# Altium schematic sheet BOC_ADC_DAC.SchDoc: Board-On-Chip Analog Interface
size A; Organization: Altium Limited; Address1: L3, 12a Rodborough Rd; Address2: Frenchs Forest; Address3: NSW; Address4: Australia 2086; Revision: 1.06; SheetNumber: 14; SheetTotal: 16
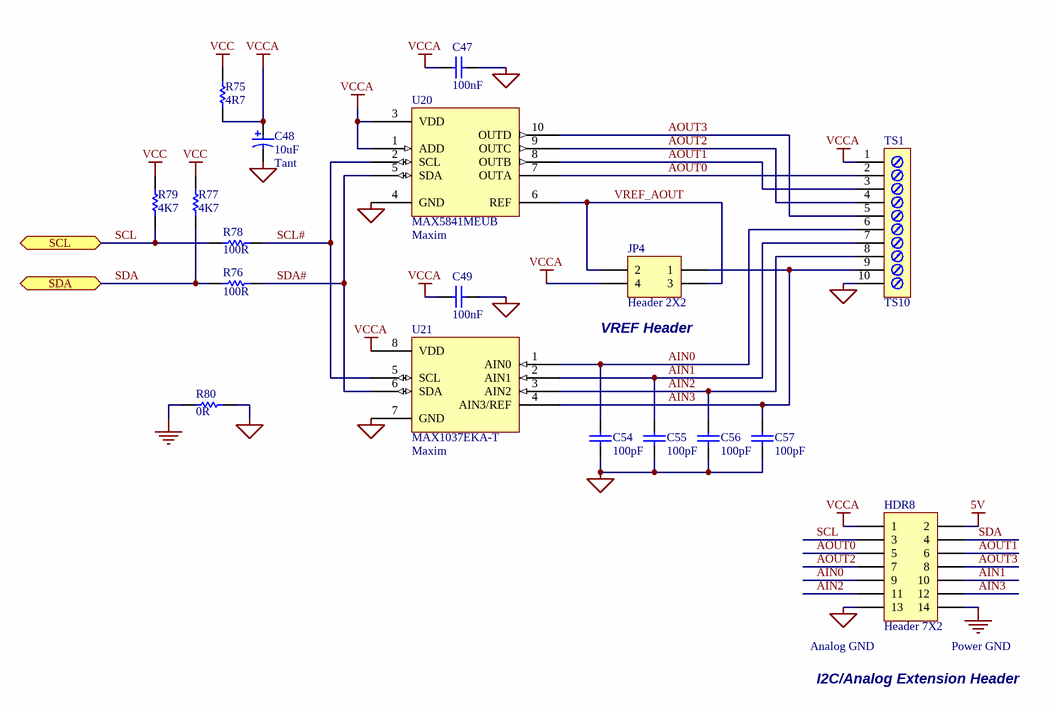
[diagram p0: BOC_ADC_DAC.SchDoc]

## Parts
C47  100nF  [CC2012-0805]
C48  10uF  Capacitor Type: Tant  [MCCT-B]
C49  100nF  [CC2012-0805]
C54  100pF  [CC2012-0805]
C55  100pF  [CC2012-0805]
C56  100pF  [CC2012-0805]
C57  100pF  [CC2012-0805]
HDR8  Header 7X2  [HDR2X7]
JP4  Header 2X2  [HDR2X2_B]
R75  4R7  [CC2012-0805]
R76  100R  [CC2012-0805]
R77  4K7  [CC2012-0805]
R78  100R  [CC2012-0805]
R79  4K7  [CC2012-0805]
R80  0R  [CC2012-0805]
TS1  TS10  [TS2.54x10]
U20  MAX5841MEUB  Supplier: Maxim  [uSOP10]
U21  MAX1037EKA-T  Manufacturer: Maxim  [SOT23_8]

## Ports
SCL (bidir), SDA (bidir)

## Nets
5V: HDR8.2
AGND: C47.2 C48.2 C49.2 C54.2 C55.2 C56.2 C57.2 HDR8.13 R80.2 TS1.10 U20.4(GND) U21.7(GND)
GND: HDR8.14 R80.1
VCC: R75.2 R77.1 R79.1
VCCA: C47.1 C48.1 C49.1 HDR8.1 JP4.4 R75.1 TS1.1 U20.1(ADD) U20.3(VDD) U21.8(VDD)
AIN0: C54.1 HDR8.9 TS1.6 U21.1(AIN0)
AIN1: C55.1 HDR8.10 TS1.7 U21.2(AIN1)
AIN2: C56.1 HDR8.11 TS1.8 U21.3(AIN2)
AIN3: C57.1 HDR8.12 JP4.1 TS1.9 U21.4(AIN3/REF)
AOUT0: HDR8.5 TS1.2 U20.7(OUTA)
AOUT1: HDR8.6 TS1.3 U20.8(OUTB)
AOUT2: HDR8.7 TS1.4 U20.9(OUTC)
AOUT3: HDR8.8 TS1.5 U20.10(OUTD)
SCL: HDR8.3 R78.1 R79.2 ; port SCL
SCL#: R78.2 U20.2(SCL) U21.5(SCL)
SDA: HDR8.4 R76.1 R77.2 ; port SDA
SDA#: R76.2 U20.5(SDA) U21.6(SDA)
VREF_AOUT: JP4.2 JP4.3 U20.6(REF)

## Notes on the sheet
- (near JP4) VREF Header
- (near HDR8) Analog GND
- I2C/Analog Extension Header
- (near HDR8) Power GND
- Title
- Size:
- Date:
- A
- Number:
- Time:
- Revision:
- Sheet
- of
- File:

## Library data of the parts
C47 C49 C54-C57 = CAP: Capacitor; Fitted: True
C48 = CAP_POLAR: Polar Capacitor; Fitted: True
HDR8 = Header 7X2: Header, 7-Pin, Dual row; Manufacturer: Generic Components; Class I: Connector; Fitted: True; Revision: July-2002: Re-released for DXP Platform.; Publisher: Altium Limited
JP4 = Header 2X2: Header, 2-Pin, Dual row; Manufacturer: Generic Components; Class I: Connector; Fitted: True; Revision: July-2002: Re-released for DXP Platform.; Publisher: Altium Limited
R75-R80 = RES: Resistor; Fitted: True
TS1 = TS10: Screw Terminal Strip, 10 Way, 2.54 mm Pitch; Fitted: True
U20 = MAX5841: 4 Channel DAC,I2C,2.7V to 5.5V; Fitted: True
U21 = MAX1037: 4 Channel 8 Bit ADC, I2C interface, 2.7V to 3.6V Supply; Fitted: True